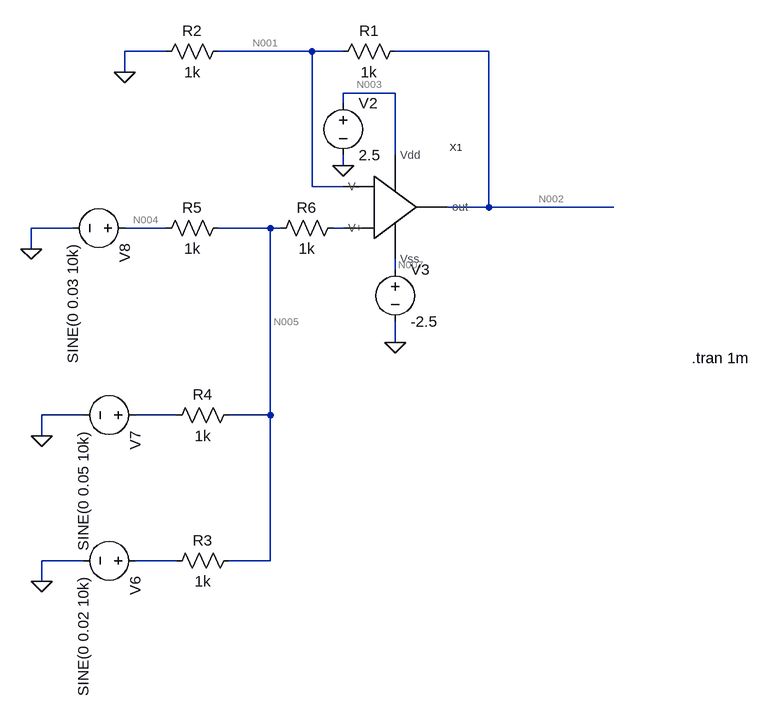
[diagram p0: schematic 2e_2.asc]
2e_2.asc, the LTspice schematic file:
Version 4
SHEET 1 880 1236
WIRE -96 -96 -160 -96
WIRE 128 -96 -16 -96
WIRE 176 -96 128 -96
WIRE 400 -96 256 -96
WIRE -160 -64 -160 -96
WIRE 256 -32 176 -32
WIRE 176 -16 176 -32
WIRE 256 64 256 -32
WIRE 176 80 176 64
WIRE 128 112 128 -96
WIRE 176 112 128 112
WIRE 400 144 400 -96
WIRE 400 144 336 144
WIRE 592 144 400 144
WIRE -240 176 -304 176
WIRE -96 176 -160 176
WIRE 64 176 -16 176
WIRE 80 176 64 176
WIRE 176 176 160 176
WIRE -304 208 -304 176
WIRE 256 240 256 224
WIRE 256 352 256 320
WIRE -224 464 -288 464
WIRE -80 464 -144 464
WIRE 64 464 64 176
WIRE 64 464 0 464
WIRE -288 496 -288 464
WIRE -224 688 -288 688
WIRE -80 688 -144 688
WIRE 64 688 64 464
WIRE 64 688 0 688
WIRE -288 720 -288 688
FLAG 256 352 0
FLAG 176 80 0
FLAG -160 -64 0
FLAG -288 720 0
FLAG -288 496 0
FLAG -304 208 0
SYMBOL res 272 -112 R90
WINDOW 0 0 56 VBottom 2
WINDOW 3 32 56 VTop 2
SYMATTR InstName R1
SYMATTR Value 1k
SYMBOL voltage 176 -32 R0
WINDOW 123 0 0 Left 0
WINDOW 39 0 0 Left 0
SYMATTR InstName V2
SYMATTR Value 2.5
SYMBOL voltage 256 224 R0
WINDOW 123 0 0 Left 0
WINDOW 39 0 0 Left 0
SYMATTR InstName V3
SYMATTR Value -2.5
SYMBOL res 0 -112 R90
WINDOW 0 0 56 VBottom 2
WINDOW 3 32 56 VTop 2
SYMATTR InstName R2
SYMATTR Value 1k
SYMBOL OPAMP 144 144 R0
SYMATTR InstName X1
SYMBOL voltage -128 688 R90
WINDOW 123 24 44 Left 2
WINDOW 39 0 0 Left 0
SYMATTR InstName V6
SYMATTR Value SINE(0 0.02 10k)
SYMBOL res 16 672 R90
WINDOW 0 0 56 VBottom 2
WINDOW 3 32 56 VTop 2
SYMATTR InstName R3
SYMATTR Value 1k
SYMBOL voltage -128 464 R90
WINDOW 123 24 44 Left 2
WINDOW 39 0 0 Left 0
SYMATTR InstName V7
SYMATTR Value SINE(0 0.05 10k)
SYMBOL res 16 448 R90
WINDOW 0 0 56 VBottom 2
WINDOW 3 32 56 VTop 2
SYMATTR InstName R4
SYMATTR Value 1k
SYMBOL voltage -144 176 R90
WINDOW 123 24 44 Left 2
WINDOW 39 0 0 Left 0
SYMATTR InstName V8
SYMATTR Value SINE(0 0.03 10k)
SYMBOL res 0 160 R90
WINDOW 0 0 56 VBottom 2
WINDOW 3 32 56 VTop 2
SYMATTR InstName R5
SYMATTR Value 1k
SYMBOL res 176 160 R90
WINDOW 0 0 56 VBottom 2
WINDOW 3 32 56 VTop 2
SYMATTR InstName R6
SYMATTR Value 1k
TEXT 712 376 Left 2 !.tran 1m

The netlist it stands for:
* 2e_2.asc
R1 N002 N001 1k
V2 N003 0 2.5
V3 N007 0 -2.5
R2 N001 0 1k
XX1 N003 N007 N001 N006 N002 OPAMP  ; pins Vdd Vss V- V+ out
V6 N009 0 SINE(0 0.02 10k)
R3 N005 N009 1k
V7 N008 0 SINE(0 0.05 10k)
R4 N005 N008 1k
V8 N004 0 SINE(0 0.03 10k)
R5 N005 N004 1k
R6 N006 N005 1k
.tran 1m
.backanno
.end

* Results of the author's LTspice run, read from the files saved beside the schematic
* Operating Point, zero values left out:
*   V(n002) = 95.18 µV
*   V(n001) = 47.59 µV
*   V(n003) = 2.5 V
*   V(n007) = -2.5 V
*   I(R1) = 47.59 nA
*   I(R2) = 47.59 nA
*   I(V2) = -188.5 µA
*   I(V3) = 188.4 µA
*   Ix(x1:VDD) = 188.5 µA
*   Ix(x1:VSS) = -188.4 µA
*   Ix(x1:OUT) = -47.59 nA
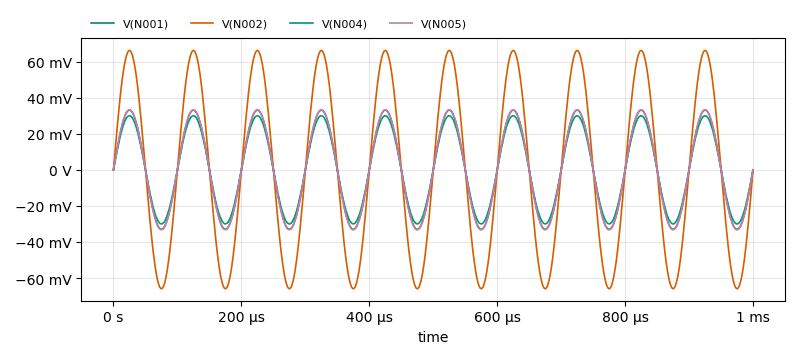
[diagram p1: Transient Analysis of 2e_2.asc, plotted from the saved traces]
* Transient Analysis, 1 run:
*   V(N001): min -32.98 mV, max 33.11 mV, average 55.43 µV, rms 23.37 mV, last -87.35 µV
*   V(N002): min -65.97 mV, max 66.22 mV, average 110.9 µV, rms 46.74 mV, last -174.7 µV
*   V(N004): min -30 mV, max 30 mV, average 0 V, rms 21.21 mV, last 0 V
*   V(N005): min -33.3 mV, max 33.3 mV, average 0 V, rms 23.55 mV, last 0 V